# Altium schematic sheet 05-DUT2-3.SchDoc
size 594 x 420 mm
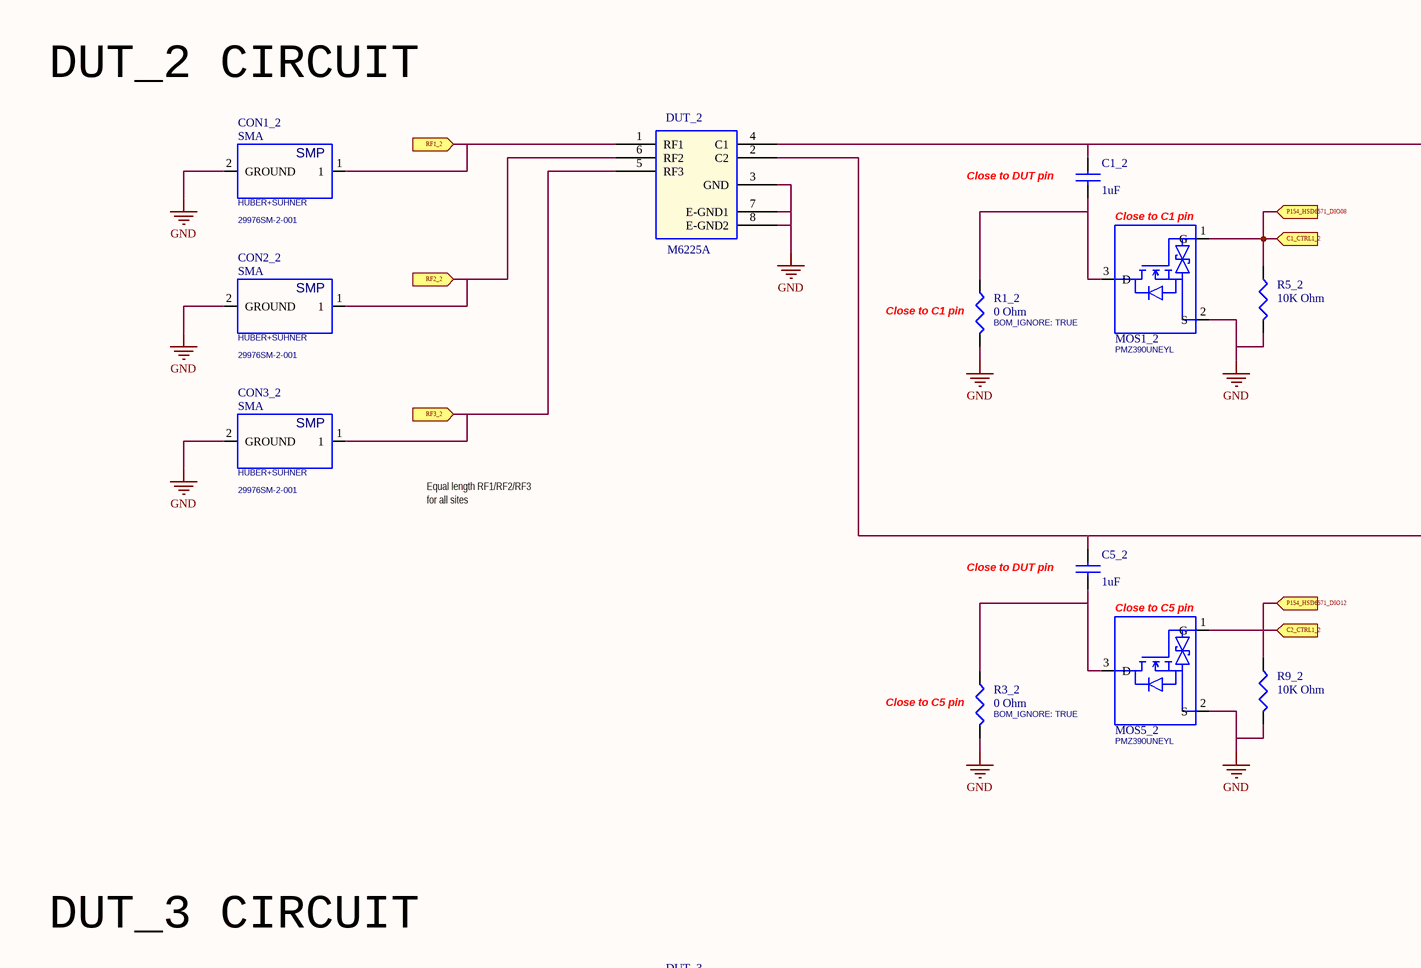
[diagram p0: 05-DUT2-3.SchDoc, top left]
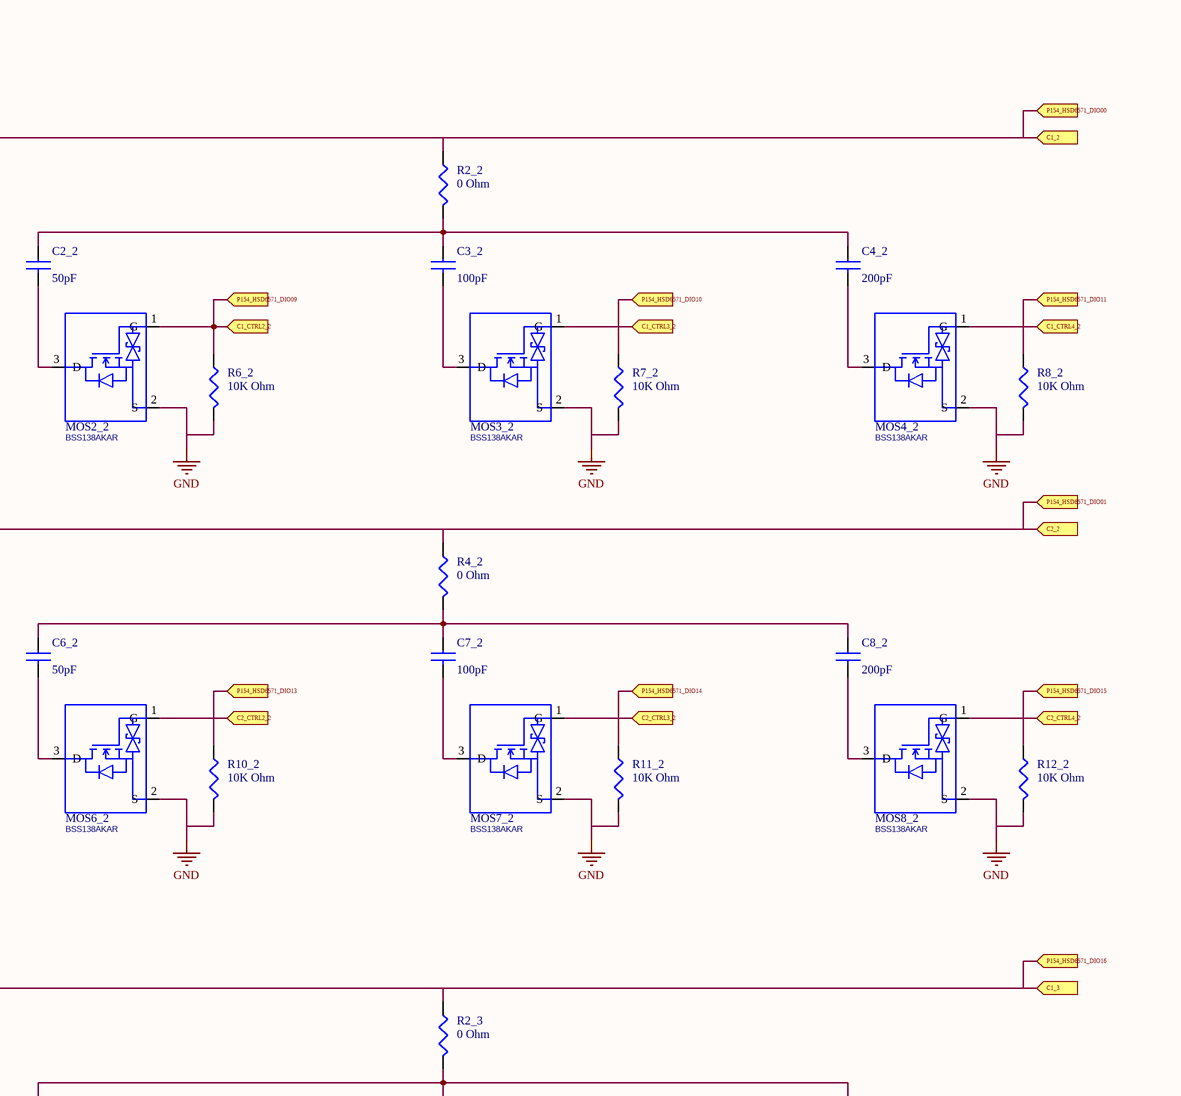
[diagram p1: 05-DUT2-3.SchDoc, top right]
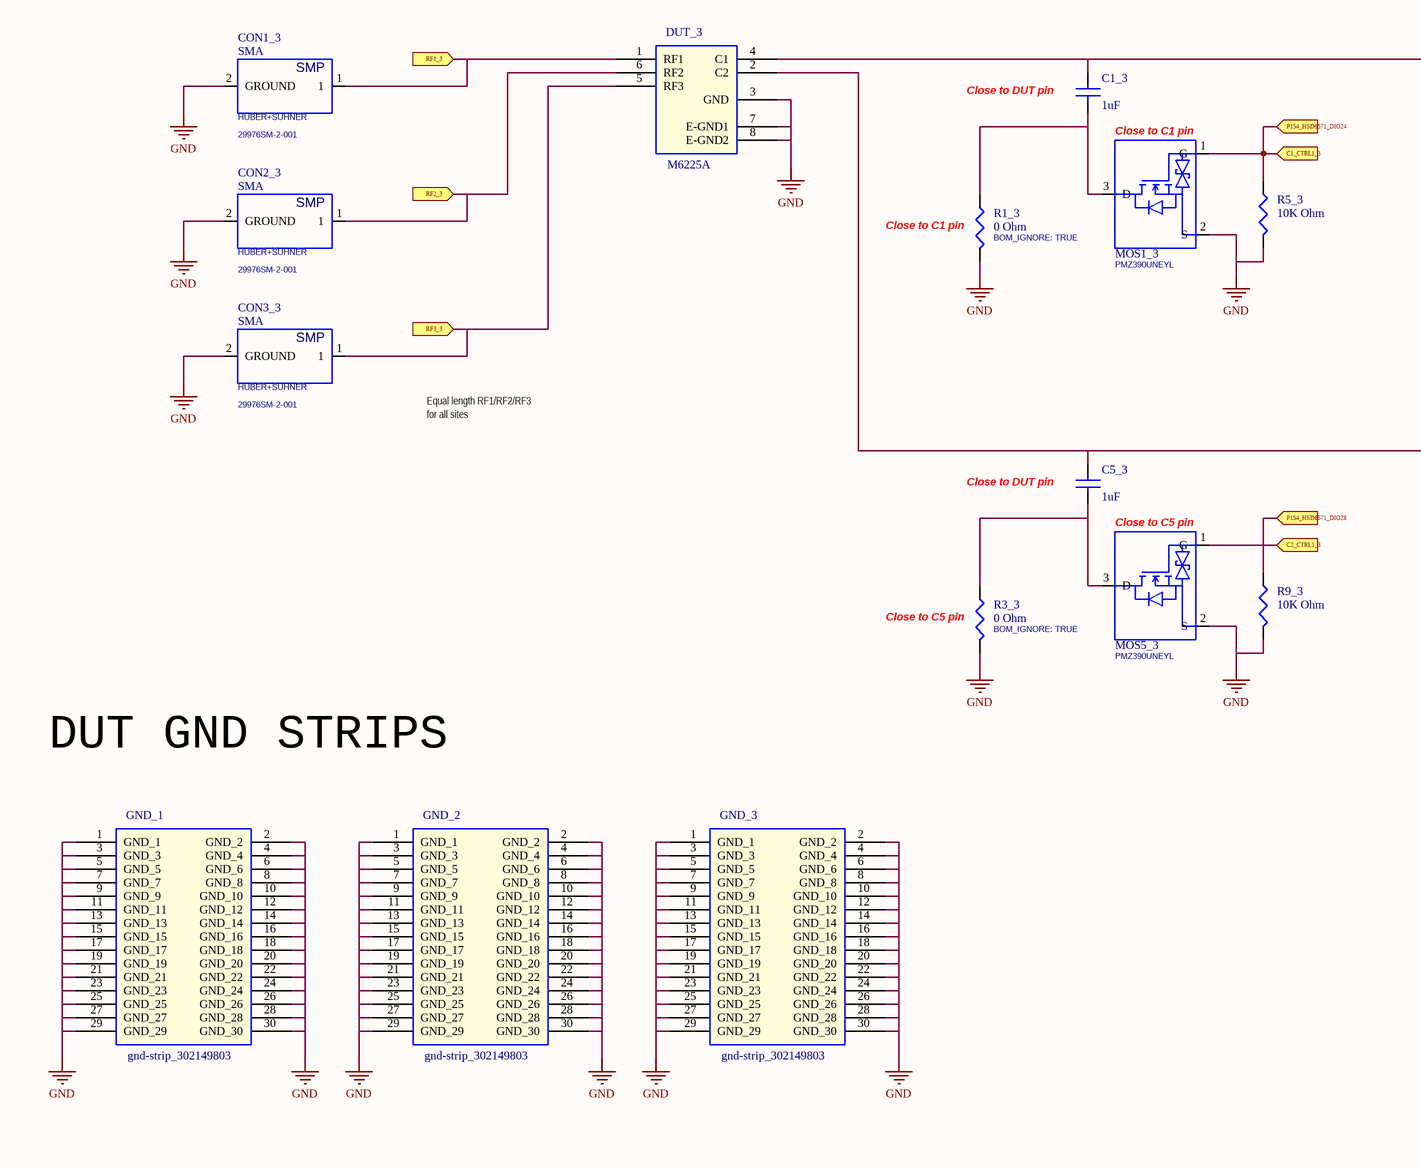
[diagram p2: 05-DUT2-3.SchDoc, bottom left]
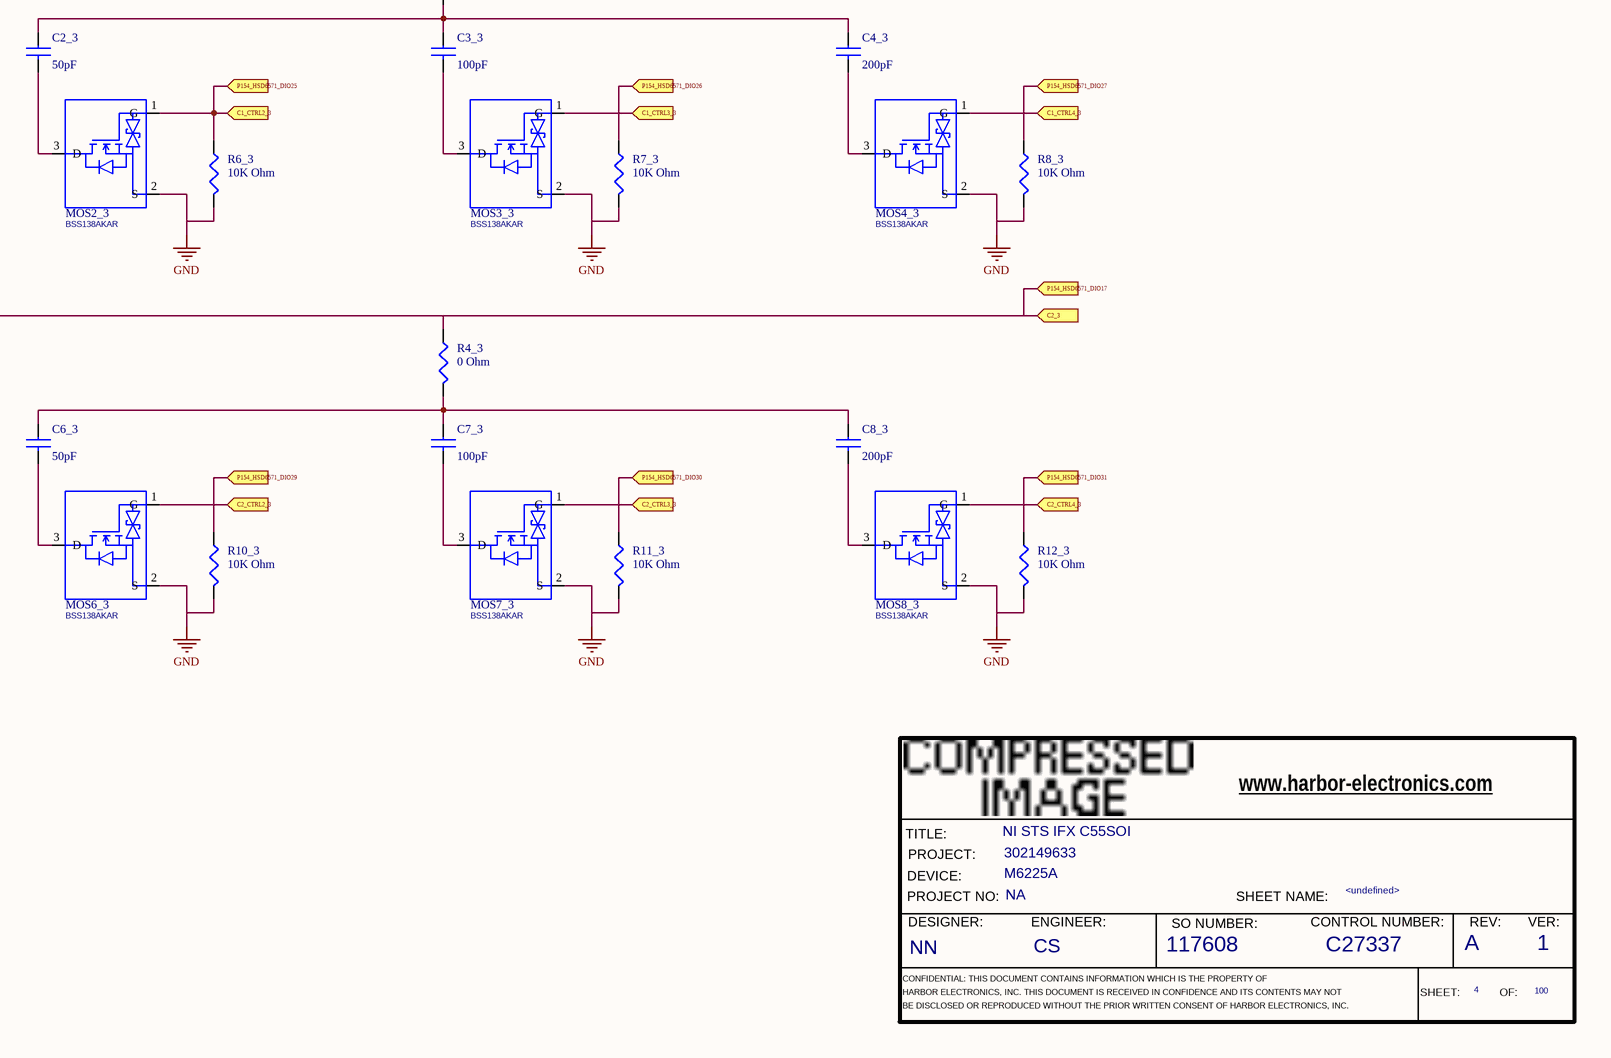
[diagram p3: 05-DUT2-3.SchDoc, bottom right]

## Parts
*  RevCode: A  Title: NI STS IFX C55SOI  Page Number: 4  Page Count: 100  Engineer: CS  Designer: NN  SO Number: 117608  Control Number: C27337  Version: 1  Page Name: <undefined>  PROJECT: 302149633  DEVICE: M6225A  PROJECT NO.: NA  (hidden comment: HE_DEFAULT)  (graphical)
C1_2  1uF  [CAPC1005X65NA]
C1_3  1uF  [CAPC1005X65NA]
C2_2  50pF  [CAPC2012X150NA]
C2_3  50pF  [CAPC2012X150NA]
C3_2  100pF  [CAPC2012X150NA]
C3_3  100pF  [CAPC2012X150NA]
C4_2  200pF  [CAPC2012X150NA]
C4_3  200pF  [CAPC2012X150NA]
C5_2  1uF  [CAPC1005X65NA]
C5_3  1uF  [CAPC1005X65NA]
C6_2  50pF  [CAPC2012X150NA]
C6_3  50pF  [CAPC2012X150NA]
C7_2  100pF  [CAPC2012X150NA]
C7_3  100pF  [CAPC2012X150NA]
C8_2  200pF  [CAPC2012X150NA]
C8_3  200pF  [CAPC2012X150NA]
CON1_2  SMA  PART_NUMBER: 29976SM-2-001  MANUFACTURER: HUBER+SUHNER  [HUBER_SUHNER_29976SM_2_001NA]
CON1_3  SMA  PART_NUMBER: 29976SM-2-001  MANUFACTURER: HUBER+SUHNER  [HUBER_SUHNER_29976SM_2_001NA]
CON2_2  SMA  MANUFACTURER: HUBER+SUHNER  PART_NUMBER: 29976SM-2-001  [HUBER_SUHNER_29976SM_2_001NA]
CON2_3  SMA  MANUFACTURER: HUBER+SUHNER  PART_NUMBER: 29976SM-2-001  [HUBER_SUHNER_29976SM_2_001NA]
CON3_2  SMA  MANUFACTURER: HUBER+SUHNER  PART_NUMBER: 29976SM-2-001  [HUBER_SUHNER_29976SM_2_001NA]
CON3_3  SMA  MANUFACTURER: HUBER+SUHNER  PART_NUMBER: 29976SM-2-001  [HUBER_SUHNER_29976SM_2_001NA]
DUT_2  M6225A  [dut_302149803]
DUT_3  M6225A  [dut_302149803]
GND_1  gnd-strip_302149803  [gnd-strip_302149803]
GND_2  gnd-strip_302149803  [gnd-strip_302149803]
GND_3  gnd-strip_302149803  [gnd-strip_302149803]
MOS1_2  PART_NUMBER: PMZ390UNEYL  [DFN1006_3NB]  (hidden comment: SINGLE)
MOS1_3  PART_NUMBER: PMZ390UNEYL  [DFN1006_3NB]  (hidden comment: SINGLE)
MOS2_2  SINGLE  [SOT95P240X130_3NA]  (value not drawn)
MOS2_3  SINGLE  [SOT95P240X130_3NA]  (value not drawn)
MOS3_2  SINGLE  [SOT95P240X130_3NA]  (value not drawn)
MOS3_3  SINGLE  [SOT95P240X130_3NA]  (value not drawn)
MOS4_2  SINGLE  [SOT95P240X130_3NA]  (value not drawn)
MOS4_3  SINGLE  [SOT95P240X130_3NA]  (value not drawn)
MOS5_2  PART_NUMBER: PMZ390UNEYL  [DFN1006_3NB]  (hidden comment: SINGLE)
MOS5_3  PART_NUMBER: PMZ390UNEYL  [DFN1006_3NB]  (hidden comment: SINGLE)
MOS6_2  SINGLE  [SOT95P240X130_3NA]  (value not drawn)
MOS6_3  SINGLE  [SOT95P240X130_3NA]  (value not drawn)
MOS7_2  SINGLE  [SOT95P240X130_3NA]  (value not drawn)
MOS7_3  SINGLE  [SOT95P240X130_3NA]  (value not drawn)
MOS8_2  SINGLE  [SOT95P240X130_3NA]  (value not drawn)
MOS8_3  SINGLE  [SOT95P240X130_3NA]  (value not drawn)
R1_2  0 Ohm  BOM_IGNORE: TRUE  [RESC0603X33NB]
R1_3  0 Ohm  BOM_IGNORE: TRUE  [RESC0603X33NB]
R2_2  0 Ohm  [RESC1005X50NA]
R2_3  0 Ohm  [RESC1005X50NA]
R3_2  0 Ohm  BOM_IGNORE: TRUE  [RESC0603X33NB]
R3_3  0 Ohm  BOM_IGNORE: TRUE  [RESC0603X33NB]
R4_2  0 Ohm  [RESC1005X50NA]
R4_3  0 Ohm  [RESC1005X50NA]
R5_2  10K Ohm  [RESC2012X70NA]
R5_3  10K Ohm  [RESC2012X70NA]
R6_2  10K Ohm  [RESC2012X70NA]
R6_3  10K Ohm  [RESC2012X70NA]
R7_2  10K Ohm  [RESC2012X70NA]
R7_3  10K Ohm  [RESC2012X70NA]
R8_2  10K Ohm  [RESC2012X70NA]
R8_3  10K Ohm  [RESC2012X70NA]
R9_2  10K Ohm  [RESC2012X70NA]
R9_3  10K Ohm  [RESC2012X70NA]
R10_2  10K Ohm  [RESC2012X70NA]
R10_3  10K Ohm  [RESC2012X70NA]
R11_2  10K Ohm  [RESC2012X70NA]
R11_3  10K Ohm  [RESC2012X70NA]
R12_2  10K Ohm  [RESC2012X70NA]
R12_3  10K Ohm  [RESC2012X70NA]

## Ports
C1_2 (in), C1_3 (in), C1_CTRL1_2 (in), C1_CTRL1_3 (in), C1_CTRL2_2 (in), C1_CTRL2_3 (in), C1_CTRL3_2 (in), C1_CTRL3_3 (in), C1_CTRL4_2 (in), C1_CTRL4_3 (in), C2_2 (in), C2_3 (in), C2_CTRL1_2 (in), C2_CTRL1_3 (in), C2_CTRL2_2 (in), C2_CTRL2_3 (in), C2_CTRL3_2 (in), C2_CTRL3_3 (in), C2_CTRL4_2 (in), C2_CTRL4_3 (in), P154_HSD6571_DIO00 (in), P154_HSD6571_DIO01 (in), P154_HSD6571_DIO08 (in), P154_HSD6571_DIO09 (in), P154_HSD6571_DIO10 (in), P154_HSD6571_DIO11 (in), P154_HSD6571_DIO12 (in), P154_HSD6571_DIO13 (in), P154_HSD6571_DIO14 (in), P154_HSD6571_DIO15 (in), P154_HSD6571_DIO16 (in), P154_HSD6571_DIO17 (in), P154_HSD6571_DIO24 (in), P154_HSD6571_DIO25 (in), P154_HSD6571_DIO26 (in), P154_HSD6571_DIO27 (in), P154_HSD6571_DIO28 (in), P154_HSD6571_DIO29 (in), P154_HSD6571_DIO30 (in), P154_HSD6571_DIO31 (in), RF1_2 (in), RF1_3 (in), RF2_2 (in), RF2_3 (in), RF3_2 (in), RF3_3 (in)

## Nets
GND: CON1_2.2(GROUND) CON1_3.2(GROUND) CON2_2.2(GROUND) CON2_3.2(GROUND) CON3_2.2(GROUND) CON3_3.2(GROUND) DUT_2.3(GND) DUT_2.7(E-GND1) DUT_2.8(E-GND2) DUT_3.3(GND) DUT_3.7(E-GND1) DUT_3.8(E-GND2) GND_1.1(GND_1) GND_1.2(GND_2) GND_1.3(GND_3) GND_1.4(GND_4) GND_1.5(GND_5) GND_1.6(GND_6) GND_1.7(GND_7) GND_1.8(GND_8) GND_1.9(GND_9) GND_1.10(GND_10) GND_1.11(GND_11) GND_1.12(GND_12) GND_1.13(GND_13) GND_1.14(GND_14) GND_1.15(GND_15) GND_1.16(GND_16) GND_1.17(GND_17) GND_1.18(GND_18) GND_1.19(GND_19) GND_1.20(GND_20) GND_1.21(GND_21) GND_1.22(GND_22) GND_1.23(GND_23) GND_1.24(GND_24) GND_1.25(GND_25) GND_1.26(GND_26) GND_1.27(GND_27) GND_1.28(GND_28) GND_1.29(GND_29) GND_1.30(GND_30) GND_2.1(GND_1) GND_2.2(GND_2) GND_2.3(GND_3) GND_2.4(GND_4) GND_2.5(GND_5) GND_2.6(GND_6) GND_2.7(GND_7) GND_2.8(GND_8) GND_2.9(GND_9) GND_2.10(GND_10) GND_2.11(GND_11) GND_2.12(GND_12) GND_2.13(GND_13) GND_2.14(GND_14) GND_2.15(GND_15) GND_2.16(GND_16) GND_2.17(GND_17) GND_2.18(GND_18) GND_2.19(GND_19) GND_2.20(GND_20) GND_2.21(GND_21) GND_2.22(GND_22) GND_2.23(GND_23) GND_2.24(GND_24) GND_2.25(GND_25) GND_2.26(GND_26) GND_2.27(GND_27) GND_2.28(GND_28) GND_2.29(GND_29) GND_2.30(GND_30) GND_3.1(GND_1) GND_3.2(GND_2) GND_3.3(GND_3) GND_3.4(GND_4) GND_3.5(GND_5) GND_3.6(GND_6) GND_3.7(GND_7) GND_3.8(GND_8) GND_3.9(GND_9) GND_3.10(GND_10) GND_3.11(GND_11) GND_3.12(GND_12) GND_3.13(GND_13) GND_3.14(GND_14) GND_3.15(GND_15) GND_3.16(GND_16) GND_3.17(GND_17) GND_3.18(GND_18) GND_3.19(GND_19) GND_3.20(GND_20) GND_3.21(GND_21) GND_3.22(GND_22) GND_3.23(GND_23) GND_3.24(GND_24) GND_3.25(GND_25) GND_3.26(GND_26) GND_3.27(GND_27) GND_3.28(GND_28) GND_3.29(GND_29) GND_3.30(GND_30) MOS1_2.2(S) MOS1_3.2(S) MOS2_2.2(S) MOS2_3.2(S) MOS3_2.2(S) MOS3_3.2(S) MOS4_2.2(S) MOS4_3.2(S) MOS5_2.2(S) MOS5_3.2(S) MOS6_2.2(S) MOS6_3.2(S) MOS7_2.2(S) MOS7_3.2(S) MOS8_2.2(S) MOS8_3.2(S) R1_2.2 R1_3.2 R3_2.2 R3_3.2 R5_2.2 R5_3.2 R6_2.2 R6_3.2 R7_2.2 R7_3.2 R8_2.2 R8_3.2 R9_2.2 R9_3.2 R10_2.2 R10_3.2 R11_2.2 R11_3.2 R12_2.2 R12_3.2
C1_2: C1_2.1 DUT_2.4(C1) R2_2.1 ; port P154_HSD6571_DIO00, port C1_2
C1_3: C1_3.1 DUT_3.4(C1) R2_3.1 ; port P154_HSD6571_DIO16, port C1_3
C1_CTRL1_2: MOS1_2.1(G) R5_2.1 ; port P154_HSD6571_DIO08, port C1_CTRL1_2
C1_CTRL1_3: MOS1_3.1(G) R5_3.1 ; port P154_HSD6571_DIO24, port C1_CTRL1_3
C1_CTRL2_2: MOS2_2.1(G) R6_2.1 ; port P154_HSD6571_DIO09, port C1_CTRL2_2
C1_CTRL2_3: MOS2_3.1(G) R6_3.1 ; port P154_HSD6571_DIO25, port C1_CTRL2_3
C1_CTRL3_2: MOS3_2.1(G) ; port C1_CTRL3_2
C1_CTRL3_3: MOS3_3.1(G) ; port C1_CTRL3_3
C1_CTRL4_2: MOS4_2.1(G) ; port C1_CTRL4_2
C1_CTRL4_3: MOS4_3.1(G) ; port C1_CTRL4_3
C2_2: C5_2.1 DUT_2.2(C2) R4_2.1 ; port P154_HSD6571_DIO01, port C2_2
C2_3: C5_3.1 DUT_3.2(C2) R4_3.1 ; port P154_HSD6571_DIO17, port C2_3
C2_CTRL1_2: MOS5_2.1(G) ; port C2_CTRL1_2
C2_CTRL1_3: MOS5_3.1(G) ; port C2_CTRL1_3
C2_CTRL2_2: MOS6_2.1(G) ; port C2_CTRL2_2
C2_CTRL2_3: MOS6_3.1(G) ; port C2_CTRL2_3
C2_CTRL3_2: MOS7_2.1(G) ; port C2_CTRL3_2
C2_CTRL3_3: MOS7_3.1(G) ; port C2_CTRL3_3
C2_CTRL4_2: MOS8_2.1(G) ; port C2_CTRL4_2
C2_CTRL4_3: MOS8_3.1(G) ; port C2_CTRL4_3
P154_HSD6571_DIO10: R7_2.1 ; port P154_HSD6571_DIO10
P154_HSD6571_DIO11: R8_2.1 ; port P154_HSD6571_DIO11
P154_HSD6571_DIO12: R9_2.1 ; port P154_HSD6571_DIO12
P154_HSD6571_DIO13: R10_2.1 ; port P154_HSD6571_DIO13
P154_HSD6571_DIO14: R11_2.1 ; port P154_HSD6571_DIO14
P154_HSD6571_DIO15: R12_2.1 ; port P154_HSD6571_DIO15
P154_HSD6571_DIO26: R7_3.1 ; port P154_HSD6571_DIO26
P154_HSD6571_DIO27: R8_3.1 ; port P154_HSD6571_DIO27
P154_HSD6571_DIO28: R9_3.1 ; port P154_HSD6571_DIO28
P154_HSD6571_DIO29: R10_3.1 ; port P154_HSD6571_DIO29
P154_HSD6571_DIO30: R11_3.1 ; port P154_HSD6571_DIO30
P154_HSD6571_DIO31: R12_3.1 ; port P154_HSD6571_DIO31
RF1_2: CON1_2.1 DUT_2.1(RF1) ; port RF1_2
RF1_3: CON1_3.1 DUT_3.1(RF1) ; port RF1_3
RF2_2: CON2_2.1 DUT_2.6(RF2) ; port RF2_2
RF2_3: CON2_3.1 DUT_3.6(RF2) ; port RF2_3
RF3_2: CON3_2.1 DUT_2.5(RF3) ; port RF3_2
RF3_3: CON3_3.1 DUT_3.5(RF3) ; port RF3_3
NetC1_2_2: C1_2.2 MOS1_2.3(D) R1_2.1
NetC1_3_2: C1_3.2 MOS1_3.3(D) R1_3.1
NetC2_2_1: C2_2.1 C3_2.1 C4_2.1 R2_2.2
NetC2_2_2: C2_2.2 MOS2_2.3(D)
NetC2_3_1: C2_3.1 C3_3.1 C4_3.1 R2_3.2
NetC2_3_2: C2_3.2 MOS2_3.3(D)
NetC3_2_2: C3_2.2 MOS3_2.3(D)
NetC3_3_2: C3_3.2 MOS3_3.3(D)
NetC4_2_2: C4_2.2 MOS4_2.3(D)
NetC4_3_2: C4_3.2 MOS4_3.3(D)
NetC5_2_2: C5_2.2 MOS5_2.3(D) R3_2.1
NetC5_3_2: C5_3.2 MOS5_3.3(D) R3_3.1
NetC6_2_1: C6_2.1 C7_2.1 C8_2.1 R4_2.2
NetC6_2_2: C6_2.2 MOS6_2.3(D)
NetC6_3_1: C6_3.1 C7_3.1 C8_3.1 R4_3.2
NetC6_3_2: C6_3.2 MOS6_3.3(D)
NetC7_2_2: C7_2.2 MOS7_2.3(D)
NetC7_3_2: C7_3.2 MOS7_3.3(D)
NetC8_2_2: C8_2.2 MOS8_2.3(D)
NetC8_3_2: C8_3.2 MOS8_3.3(D)

## Notes on the sheet
- DUT_2 CIRCUIT
- (near C1_2) Close to DUT pin
- (near MOS1_2) Close to C1 pin
- (near R1_2) Close to C1 pin
- Equal length RF1/RF2/RF3
- for all sites
- (near C5_2) Close to DUT pin
- (near MOS5_2) Close to C5 pin
- (near R3_2) Close to C5 pin
- DUT_3 CIRCUIT
- (near C1_3) Close to DUT pin
- (near MOS1_3) Close to C1 pin
- (near R1_3) Close to C1 pin
- (near C5_3) Close to DUT pin
- (near MOS5_3) Close to C5 pin
- (near R3_3) Close to C5 pin
- DUT GND STRIPS
- (in symbol 29976sm_2_001) SMP
- (in symbol HE_DEFAULT) www.harbor-electronics.com; TITLE:; PROJECT:; DEVICE:; PROJECT NO:; SHEET NAME:; DESIGNER:; ENGINEER:; SO NUMBER:; CONTROL NUMBER:; REV:; VER:; CONFIDENTIAL: THIS DOCUMENT CONTAINS INFORMATION WHICH IS THE PROPERTY OF; HARBOR ELECTRONICS, INC. THIS DOCUMENT IS RECEIVED IN CONFIDENCE AND ITS CONTENTS MAY NOT; SHEET:; OF:; BE DISCLOSED OR REPRODUCED WITHOUT THE PRIOR WRITTEN CONSENT OF HARBOR ELECTRONICS, INC.

## Library data of the parts
* = HE_DEFAULT: Page Size: X; OrgAddr4: Fax: +1 602-431-9633; OrgAddr1: 4050 E. Cotton Center Blvd., Suite 33; OrgAddr2: Phoenix, Arizona 85040 U.S.A.; OrgAddr3: Phone: +1 602-438-1112; Doc: <Title Name>; OrgName: HARBOR
C1_2 C5_2 = capacitor: ALT_SYMBOLS: (CAPC1005X65N,CAPC1005X65N_NT,CAPC1005X65L,CAPC1005X65NA_HS); CLASS: DISCRETE; PCB Footprint: CAPC1005X65NA; LIB_NAME: Capacitor; HEIGHT: 0.5 mm
C1_3 C5_3 = capacitor: CLASS: DISCRETE; ALT_SYMBOLS: (CAPC1005X65N,CAPC1005X65N_NT,CAPC1005X65L,CAPC1005X65NA_HS); PCB Footprint: CAPC1005X65NA; HEIGHT: 0.5 mm; LIB_NAME: Capacitor
C2_2 C6_2 = capacitor: Cap Ceramic 50pF 100V C0G 1% Pad SMD 0805 125degC; PART_NUMBER: 08051A500FAT2A; MANUFACTURER: KYOCERA AVX Components Corporation; CLASS: DISCRETE; ALT_SYMBOLS: (CAPC2012X150N,CAPC2012X150L); LIB_NAME: z_Capacitor_Individual; PCB Footprint: CAPC2012X150NA; HEIGHT: 0.94 mm
C2_3 C6_3 = capacitor: Cap Ceramic 50pF 100V C0G 1% Pad SMD 0805 125degC; MANUFACTURER: KYOCERA AVX Components Corporation; PART_NUMBER: 08051A500FAT2A; LIB_NAME: z_Capacitor_Individual; ALT_SYMBOLS: (CAPC2012X150N,CAPC2012X150L); CLASS: DISCRETE; PCB Footprint: CAPC2012X150NA; HEIGHT: 0.94 mm
C3_2 C7_2 = capacitor: CLASS: DISCRETE; ALT_SYMBOLS: (CAPC2012X150N,CAPC2012X150L); PCB Footprint: CAPC2012X150NA; HEIGHT: 0.94(Max) mm; LIB_NAME: Capacitor
C3_3 C7_3 = capacitor: ALT_SYMBOLS: (CAPC2012X150N,CAPC2012X150L); CLASS: DISCRETE; PCB Footprint: CAPC2012X150NA; LIB_NAME: Capacitor; HEIGHT: 0.94(Max) mm
C4_2 C8_3 = capacitor: Cap Ceramic 200pF 50V C0G 1% Pad SMD 0805 125degC; PART_NUMBER: 08055A201FAT2A; MANUFACTURER: KYOCERA AVX Components Corporation; CLASS: DISCRETE; ALT_SYMBOLS: (CAPC2012X150N,CAPC2012X150L); LIB_NAME: z_Capacitor_Individual; PCB Footprint: CAPC2012X150NA; HEIGHT: 0.94 mm
C4_3 C8_2 = capacitor: Cap Ceramic 200pF 50V C0G 1% Pad SMD 0805 125degC; MANUFACTURER: KYOCERA AVX Components Corporation; PART_NUMBER: 08055A201FAT2A; LIB_NAME: z_Capacitor_Individual; ALT_SYMBOLS: (CAPC2012X150N,CAPC2012X150L); CLASS: DISCRETE; PCB Footprint: CAPC2012X150NA; HEIGHT: 0.94 mm
CON1_2 CON1_3 = 29976sm_2_001: RF Coaxial Connectors; CLASS: IC; ALT_SYMBOLS: (HUBER_SUHNER_29976SM_2_001N,HUBER_SUHNER_29976SM_2_001_OPT1); LIB_NAME: z_Connector_Individual; PCB Footprint: HUBER_SUHNER_29976SM_2_001NA; HEIGHT: 5.237 MM
CON2_2 CON2_3 CON3_2 CON3_3 = 29976sm_2_001: RF Coaxial Connectors; LIB_NAME: z_Connector_Individual; ALT_SYMBOLS: (HUBER_SUHNER_29976SM_2_001N,HUBER_SUHNER_29976SM_2_001_OPT1); CLASS: IC; PCB Footprint: HUBER_SUHNER_29976SM_2_001NA; HEIGHT: 5.237 MM
MOS1_2 MOS1_3 MOS5_2 = pmz390une: Trans MOSFET N-CH 30V 0.9A 3-Pin DFN; MANUFACTURER: Nexperia; LIB_NAME: z_Transistor_Individual; ALT_SYMBOLS: (DFN1006_3N); CLASS: IC; HEIGHT: 0.50 MM; PCB Footprint: DFN1006_3NB
MOS2_2 MOS3_3 MOS4_3 MOS6_2 MOS7_3 MOS8_3 = bss138akar: Trans MOSFET N-CH 60V 0.2A Automotive AEC-Q101 3-Pin SOT-23; MANUFACTURER: Nexperia; LIB_NAME: z_Transistor_Individual; ALT_SYMBOLS: (SOT95P240X130_3N); CLASS: IC; PCB Footprint: SOT95P240X130_3NA; PART_NUMBER: BSS138AKAR; HEIGHT: 1.10 MM
MOS2_3 MOS3_2 MOS4_2 MOS6_3 MOS7_2 MOS8_2 = bss138akar: Trans MOSFET N-CH 60V 0.2A Automotive AEC-Q101 3-Pin SOT-23; MANUFACTURER: Nexperia; CLASS: IC; ALT_SYMBOLS: (SOT95P240X130_3N); LIB_NAME: z_Transistor_Individual; PCB Footprint: SOT95P240X130_3NA; HEIGHT: 1.10 MM; PART_NUMBER: BSS138AKAR
MOS5_3 = pmz390une: Trans MOSFET N-CH 30V 0.9A 3-Pin DFN; MANUFACTURER: Nexperia; CLASS: IC; ALT_SYMBOLS: (DFN1006_3N); LIB_NAME: z_Transistor_Individual; HEIGHT: 0.50 MM; PCB Footprint: DFN1006_3NB
R1_2 R1_3 R3_2 R3_3 = resistor: AML_PN: 775-1493-00; ALT_SYMBOLS: (RESC0603X33N,RESC0603X33L); CLASS: DISCRETE; LIB_NAME: Resistor; HEIGHT: 0.23 mm; PCB Footprint: RESC0603X33NB
R2_2 R4_3 = resistor: CLASS: DISCRETE; ALT_SYMBOLS: (RESC1005X60N_NTA;RESC1005X50N;RESC1005X50NA_HS;RESC1005X60L); AML_PN: 775-0014-00; PCB Footprint: RESC1005X50NA; HEIGHT: 0.35 mm; LIB_NAME: Resistor
R2_3 R4_2 = resistor: AML_PN: 775-0014-00; ALT_SYMBOLS: (RESC1005X60N_NTA;RESC1005X50N;RESC1005X50NA_HS;RESC1005X60L); CLASS: DISCRETE; PCB Footprint: RESC1005X50NA; LIB_NAME: Resistor; HEIGHT: 0.35 mm
R5_2 R6_2 R7_2 R8_2 R9_2 R10_2 R11_2 R12_2 = resistor: Res Thick Film 0805 10K Ohm 0.5% 0.5W(1/2W) +/-100ppm/degC Pad SMD  Automotive AEC-Q200; MANUFACTURER: Panasonic; PART_NUMBER: ERJHP6D1002V; LIB_NAME: z_Resistor_Individual; AML_PN: 775-2282-00-01; ALT_SYMBOLS: (RESC2012X70N,RESC2012X84L); CLASS: DISCRETE; PCB Footprint: RESC2012X70NA; HEIGHT: 0.70 mm
R5_3 R6_3 R7_3 R8_3 R9_3 R10_3 R11_3 R12_3 = resistor: Res Thick Film 0805 10K Ohm 0.5% 0.5W(1/2W) +/-100ppm/degC Pad SMD  Automotive AEC-Q200; PART_NUMBER: ERJHP6D1002V; MANUFACTURER: Panasonic; CLASS: DISCRETE; ALT_SYMBOLS: (RESC2012X70N,RESC2012X84L); AML_PN: 775-2282-00-01; LIB_NAME: z_Resistor_Individual; PCB Footprint: RESC2012X70NA; HEIGHT: 0.70 mm
DUT_2 DUT_3 = M6225A: PCB Footprint: dut_302149803
GND_1-GND_3 = gnd-strip_302149803: PCB Footprint: gnd-strip_302149803